# Altium schematic sheet MCU.SchDoc
size A
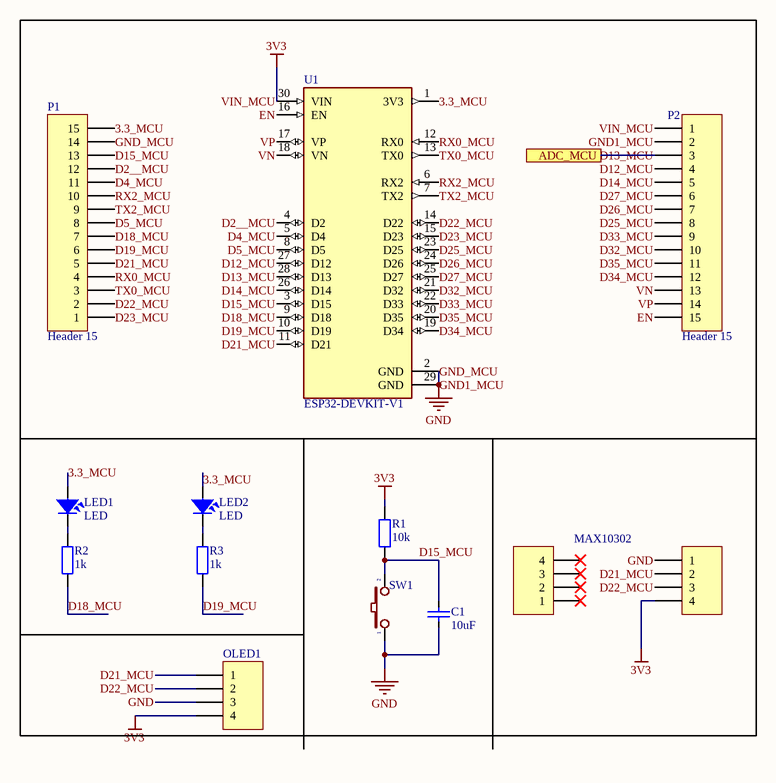
[diagram p0: MCU.SchDoc]

## Parts
C1  10uF  [CAP_0805]
LED1  LED  [LED-0805-Blue]
LED2  LED  [LED-0805-Blue]
MAX10302  Header 4  [HDR1X4]  (value not drawn)
OLED1  LCD  [HDR1X4]  (value not drawn)
P1  Header 15  [HDR1X15]
P2  Header 15  [HDR1X15]
P3  Header 4  [HDR1X4]  (value not drawn)
R1  10k  [RES-SMD-0805]
R2  1k  [RES-SMD-0805]
R3  1k  [RES-SMD-0805]
SW1  SW  [SW2]  (value not drawn)
U1  ESP32-DEVKIT-V1  [MODULE_ESP32_DEVKIT_V1]

## Ports
ADC_MCU

## Nets
GND: C1.1 MAX10302.1 OLED1.3 P1.14 P2.2 SW1.1 U1.2(GND) U1.29(GND)  [also labelled GND1_MCU, GND_MCU]
VIN_MCU: MAX10302.4 OLED1.4 P2.1 R1.1 U1.30(VIN)  [also labelled 3V3]
3.3_MCU: LED1.1 LED2.1 P1.15 U1.1(3V3)
D2__MCU: P1.12 U1.4(D2)
D4_MCU: P1.11 U1.5(D4)
D5_MCU: P1.8 U1.8(D5)
D12_MCU: P2.4 U1.27(D12)
D13_MCU: P2.3 U1.28(D13) ; port ADC_MCU
D14_MCU: P2.5 U1.26(D14)
D15_MCU: C1.2 P1.13 R1.2 SW1.2 U1.3(D15)
D18_MCU: P1.7 R2.2 U1.9(D18)
D19_MCU: P1.6 R3.2 U1.10(D19)
D21_MCU: MAX10302.2 OLED1.1 P1.5 U1.11(D21)
D22_MCU: MAX10302.3 OLED1.2 P1.2 U1.14(D22)
D23_MCU: P1.1 U1.15(D23)
D25_MCU: P2.8 U1.23(D25)
D26_MCU: P2.7 U1.24(D26)
D27_MCU: P2.6 U1.25(D27)
D32_MCU: P2.10 U1.21(D32)
D33_MCU: P2.9 U1.22(D33)
D34_MCU: P2.12 U1.19(D34)
D35_MCU: P2.11 U1.20(D35)
EN: P2.15 U1.16(EN)
RX0_MCU: P1.4 U1.12(RX0)
RX2_MCU: P1.10 U1.6(RX2)
TX0_MCU: P1.3 U1.13(TX0)
TX2_MCU: P1.9 U1.7(TX2)
VN: P2.13 U1.18(VN)
VP: P2.14 U1.17(VP)
NetLED1_2: LED1.2 R2.1
NetLED2_2: LED2.2 R3.1

Not connected (* = marked no-connect by the designer): P3 1* 2* 3* 4*

## Library data of the parts
C1 = CapSMD: Capacitor; Value: 33p; Published: 8-Jun-2000; LatestRevisionDate: 17-Jul-2002; LatestRevisionNote: Re-released for DXP Platform.; PackageReference: RAD-0.3; Publisher: Altium Limited
LED1 LED2 = LED: LED Single colour Green and Red; Value: LED 3 ly Single Colour
MAX10302 OLED1 P3 = Header 4: Header, 4-Pin; LatestRevisionDate: 17-Jul-2002; LatestRevisionNote: Re-released for DXP Platform.; Publisher: Altium Limited
P1 P2 = Header 15: Header, 15-Pin; LatestRevisionDate: 17-Jul-2002; LatestRevisionNote: Re-released for DXP Platform.; Publisher: Altium Limited
R1-R3 = Resistor - SMD: Resistor SMD; Manufacturer: Generic Components; Class: Passive; Published: 08/06/2000; Publisher: Altium Hobart Technology Centre
SW1 = SW2: Switch button 2 pin; Value: SW chip 2 pin
U1 = ESP32-DEVKIT-V1: Dual core, Wi-Fi: 2.4 GHz up to 150 Mbits/s,BLE (Bluetooth Low Energy) and legacy Bluetooth, 32 bits, Up to 240 MHz; MF: Do it; Price: None; Availability: Not in stock; Package: None; MP: ESP32-DEVKIT-V1; Value: *; SnapEDA_Link: https://www.snapeda.com/parts/ESP32-DEVKIT-V1/Do+it/view-part/?ref=snap; Check_prices: https://www.snapeda.com/parts/ESP32-DEVKIT-V1/Do+it/view-part/?ref=eda